# Altium project 3PO.PrjPcb
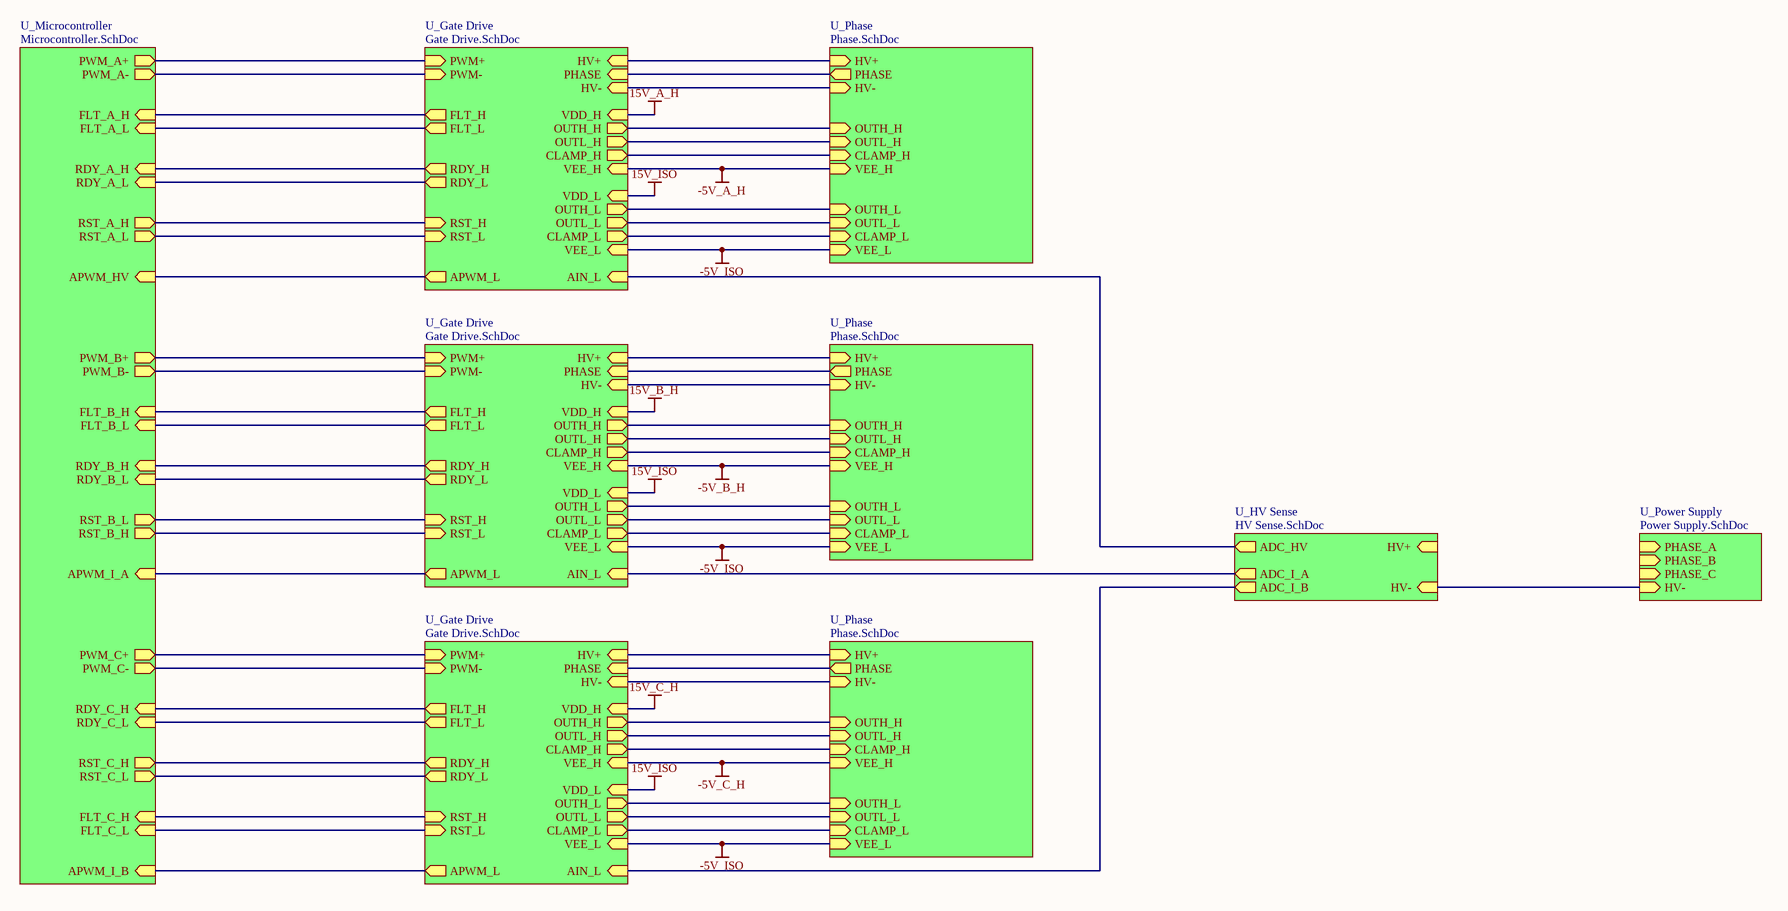
[diagram p0: Inverter.SchDoc]
EngineerName: Ryan Tran; PartNumber: N/A; Project: 3PO, Inverter; Rev: A; SCH_SCALE: 1:1
6 sheets, 166 parts. Net scope: hierarchical (ports join the sheet entries above them; power ports are global).
Sheets:
  Inverter.SchDoc
    U_Phase = Phase.SchDoc
    U_Gate Drive = Gate Drive.SchDoc
    U_Power Supply = Power Supply.SchDoc
    U_HV Sense = HV Sense.SchDoc
    U_Phase = Phase.SchDoc
    U_Gate Drive = Gate Drive.SchDoc
    U_Phase = Phase.SchDoc
    U_Gate Drive = Gate Drive.SchDoc
    U_Microcontroller = Microcontroller.SchDoc

## Sheet Inverter.SchDoc
size 431 x 279 mm; SheetNumber: 1; SheetTotal: 6

### Sub-sheets
U_Gate Drive = Gate Drive.SchDoc: PWM+ (in), PWM- (in), FLT_H (out), RDY_H (out), RST_H (in), OUTL_H (out), OUTH_H (out), CLAMP_H (out), FLT_L (out), OUTL_L (out), OUTH_L (out), CLAMP_L (out), RDY_L (out), HV- (in), RST_L (in), HV+ (in), PHASE (in), VEE_L (in), VDD_L (in), VDD_H (in), VEE_H (in), AIN_L (in), APWM_L (out)
U_Gate Drive = Gate Drive.SchDoc: PWM+ (in), PWM- (in), FLT_H (out), RDY_H (out), RST_H (in), OUTL_H (out), OUTH_H (out), CLAMP_H (out), FLT_L (out), OUTL_L (out), OUTH_L (out), CLAMP_L (out), RDY_L (out), HV- (in), RST_L (in), HV+ (in), PHASE (in), VEE_L (in), VDD_L (in), VDD_H (in), VEE_H (in), AIN_L (in), APWM_L (out)
U_Gate Drive = Gate Drive.SchDoc: PWM+ (in), PWM- (in), FLT_H (out), RDY_H (out), RST_H (in), OUTL_H (out), OUTH_H (out), CLAMP_H (out), FLT_L (out), OUTL_L (out), OUTH_L (out), CLAMP_L (out), RDY_L (out), HV- (in), RST_L (in), HV+ (in), PHASE (in), VEE_L (in), VDD_L (in), VDD_H (in), VEE_H (in), AIN_L (in), APWM_L (out)
U_HV Sense = HV Sense.SchDoc: HV- (in), HV+ (in), ADC_HV (out), ADC_I_A (out), ADC_I_B (out)
U_Microcontroller = Microcontroller.SchDoc: PWM_A+ (out), PWM_A- (out), PWM_B+ (out), PWM_B- (out), PWM_C+ (out), PWM_C- (out), FLT_A_L (in), FLT_A_H (in), FLT_B_L (in), FLT_B_H (in), FLT_C_L (in), FLT_C_H (in), RDY_A_L (in), RDY_A_H (in), RDY_B_L (in), RDY_B_H (in), RDY_C_L (in), RDY_C_H (in), RST_A_L (out), RST_A_H (out), RST_B_L (out), RST_B_H (out), RST_C_L (out), RST_C_H (out), APWM_I_A (in), APWM_HV (in), APWM_I_B (in)
U_Phase = Phase.SchDoc: OUTH_H (in), OUTL_H (in), PHASE (out), CLAMP_H (in), VEE_H (in), OUTH_L (in), OUTL_L (in), CLAMP_L (in), VEE_L (in), HV+ (in), HV- (in)
U_Phase = Phase.SchDoc: OUTH_H (in), OUTL_H (in), PHASE (out), CLAMP_H (in), VEE_H (in), OUTH_L (in), OUTL_L (in), CLAMP_L (in), VEE_L (in), HV+ (in), HV- (in)
U_Phase = Phase.SchDoc: OUTH_H (in), OUTL_H (in), PHASE (out), CLAMP_H (in), VEE_H (in), OUTH_L (in), OUTL_L (in), CLAMP_L (in), VEE_L (in), HV+ (in), HV- (in)
U_Power Supply = Power Supply.SchDoc: PHASE_A (in), PHASE_B (in), PHASE_C (in), HV- (in)

### Nets
15V_ISO: sheet U_Gate Drive/VDD_L, sheet U_Gate Drive/VDD_L, sheet U_Gate Drive/VDD_L
-5V_A_H: sheet U_Phase/VEE_H, sheet U_Gate Drive/VEE_H
-5V_B_H: sheet U_Phase/VEE_H, sheet U_Gate Drive/VEE_H
-5V_C_H: sheet U_Phase/VEE_H, sheet U_Gate Drive/VEE_H
-5V_ISO: sheet U_Phase/VEE_L, sheet U_Gate Drive/VEE_L, sheet U_Phase/VEE_L, sheet U_Gate Drive/VEE_L, sheet U_Phase/VEE_L, sheet U_Gate Drive/VEE_L
PHASE: sheet U_Phase/PHASE, sheet U_Gate Drive/PHASE
PHASE: sheet U_Phase/PHASE, sheet U_Gate Drive/PHASE  [a separate net that carries the same name]
PHASE: sheet U_Phase/PHASE, sheet U_Gate Drive/PHASE  [a separate net that carries the same name]
PWM+: sheet U_Gate Drive/PWM+, sheet U_Microcontroller/PWM_A+
PWM+: sheet U_Gate Drive/PWM+, sheet U_Microcontroller/PWM_B+  [a separate net that carries the same name]
PWM+: sheet U_Gate Drive/PWM+, sheet U_Microcontroller/PWM_C+  [a separate net that carries the same name]
PWM-: sheet U_Gate Drive/PWM-, sheet U_Microcontroller/PWM_A-
PWM-: sheet U_Gate Drive/PWM-, sheet U_Microcontroller/PWM_B-  [a separate net that carries the same name]
PWM-: sheet U_Gate Drive/PWM-, sheet U_Microcontroller/PWM_C-  [a separate net that carries the same name]
NetC11_U_Gate_Drive#1_1: sheet U_Phase/HV-, sheet U_Gate Drive/HV-
NetC11_U_Gate_Drive#2_1: sheet U_Phase/HV-, sheet U_Gate Drive/HV-
NetC11_U_Gate_Drive#3_1: sheet U_Phase/HV-, sheet U_Gate Drive/HV-
NetD1_U_Gate_Drive#1_2: sheet U_Phase/HV+, sheet U_Gate Drive/HV+
NetD1_U_Gate_Drive#2_2: sheet U_Phase/HV+, sheet U_Gate Drive/HV+
NetD1_U_Gate_Drive#3_2: sheet U_Phase/HV+, sheet U_Gate Drive/HV+
NetJ1_50: sheet U_Gate Drive/FLT_H, sheet U_Microcontroller/FLT_A_H
NetJ1_52: sheet U_Gate Drive/FLT_L, sheet U_Microcontroller/FLT_A_L
NetJ1_54: sheet U_Gate Drive/FLT_H, sheet U_Microcontroller/FLT_B_H
NetJ1_56: sheet U_Gate Drive/FLT_L, sheet U_Microcontroller/FLT_B_L
NetJ1_58: sheet U_Gate Drive/RST_H, sheet U_Microcontroller/FLT_C_H
NetJ1_60: sheet U_Gate Drive/RST_L, sheet U_Microcontroller/FLT_C_L
NetJ1_66: sheet U_Gate Drive/RST_H, sheet U_Microcontroller/RST_A_H
NetJ1_67: sheet U_Gate Drive/RDY_H, sheet U_Microcontroller/RDY_A_H
NetJ1_68: sheet U_Gate Drive/RST_L, sheet U_Microcontroller/RST_A_L
NetJ1_69: sheet U_Gate Drive/RDY_L, sheet U_Microcontroller/RDY_A_L
NetJ1_70: sheet U_Gate Drive/RST_L, sheet U_Microcontroller/RST_B_H
NetJ1_71: sheet U_Gate Drive/RDY_H, sheet U_Microcontroller/RDY_B_H
NetJ1_72: sheet U_Gate Drive/RST_H, sheet U_Microcontroller/RST_B_L
NetJ1_73: sheet U_Gate Drive/RDY_L, sheet U_Microcontroller/RDY_B_L
NetJ1_74: sheet U_Gate Drive/RDY_H, sheet U_Microcontroller/RST_C_H
NetJ1_75: sheet U_Gate Drive/FLT_H, sheet U_Microcontroller/RDY_C_H
NetJ1_76: sheet U_Gate Drive/RDY_L, sheet U_Microcontroller/RST_C_L
NetJ1_77: sheet U_Gate Drive/FLT_L, sheet U_Microcontroller/RDY_C_L
NetJ1_78: sheet U_Gate Drive/APWM_L, sheet U_Microcontroller/APWM_HV
NetJ1_80: sheet U_Gate Drive/APWM_L, sheet U_Microcontroller/APWM_I_A
NetJ1_82: sheet U_Gate Drive/APWM_L, sheet U_Microcontroller/APWM_I_B
NetPS4_6: sheet U_Power Supply/HV-, sheet U_HV Sense/HV-
NetR15_U_Phase#1_1: sheet U_Phase/OUTL_H, sheet U_Gate Drive/OUTL_H
NetR15_U_Phase#2_1: sheet U_Phase/OUTL_H, sheet U_Gate Drive/OUTL_H
NetR15_U_Phase#3_1: sheet U_Phase/OUTL_H, sheet U_Gate Drive/OUTL_H
NetR16_U_Phase#1_1: sheet U_Phase/OUTH_H, sheet U_Gate Drive/OUTH_H
NetR16_U_Phase#2_1: sheet U_Phase/OUTH_H, sheet U_Gate Drive/OUTH_H
NetR16_U_Phase#3_1: sheet U_Phase/OUTH_H, sheet U_Gate Drive/OUTH_H
NetR19_U_Phase#1_1: sheet U_Phase/CLAMP_H, sheet U_Gate Drive/CLAMP_H
NetR19_U_Phase#2_1: sheet U_Phase/CLAMP_H, sheet U_Gate Drive/CLAMP_H
NetR19_U_Phase#3_1: sheet U_Phase/CLAMP_H, sheet U_Gate Drive/CLAMP_H
NetR21_U_Phase#1_1: sheet U_Phase/OUTL_L, sheet U_Gate Drive/OUTL_L
NetR21_U_Phase#2_1: sheet U_Phase/OUTL_L, sheet U_Gate Drive/OUTL_L
NetR21_U_Phase#3_1: sheet U_Phase/OUTL_L, sheet U_Gate Drive/OUTL_L
NetR22_U_Phase#1_1: sheet U_Phase/OUTH_L, sheet U_Gate Drive/OUTH_L
NetR22_U_Phase#2_1: sheet U_Phase/OUTH_L, sheet U_Gate Drive/OUTH_L
NetR22_U_Phase#3_1: sheet U_Phase/OUTH_L, sheet U_Gate Drive/OUTH_L
NetR25_U_Phase#1_1: sheet U_Phase/CLAMP_L, sheet U_Gate Drive/CLAMP_L
NetR25_U_Phase#2_1: sheet U_Phase/CLAMP_L, sheet U_Gate Drive/CLAMP_L
NetR25_U_Phase#3_1: sheet U_Phase/CLAMP_L, sheet U_Gate Drive/CLAMP_L
NetR36_1: sheet U_Gate Drive/AIN_L, sheet U_HV Sense/ADC_HV
NetU2_U_Gate_Drive#2_1: sheet U_HV Sense/ADC_I_A, sheet U_Gate Drive/AIN_L
NetU2_U_Gate_Drive#3_1: sheet U_HV Sense/ADC_I_B, sheet U_Gate Drive/AIN_L

### Notes on the sheet
- Title
- Project
- Scale
- Size
- B
- Part Number
- Engineer
- Sheet
- of
- Rev

## Sheet Phase.SchDoc
size 431 x 279 mm; SheetNumber: 3; SheetTotal: 4
Used 3 times, as channels U_Phase, U_Phase, U_Phase. Parts and nets are listed once, with the designators drawn on the sheet.
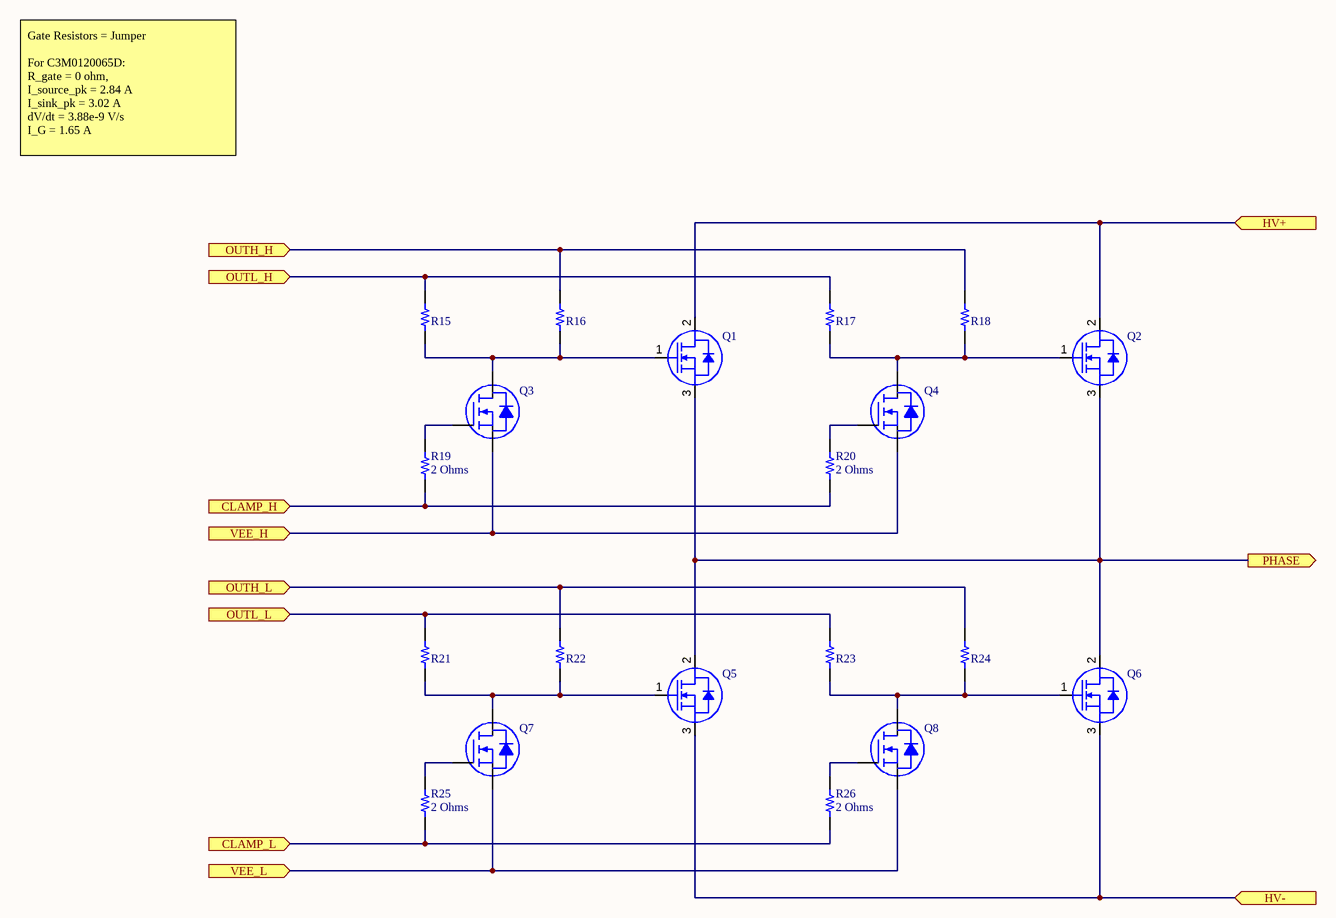
[diagram p1: Phase.SchDoc]

### Parts
Q1  C3M0120065D  (value not drawn)
Q2  C3M0120065D  (value not drawn)
Q3  IRFML8244TRPBF  [INFINEON SOT-23-3]  (value not drawn)
Q4  IRFML8244TRPBF  [INFINEON SOT-23-3]  (value not drawn)
Q5  C3M0120065D  (value not drawn)
Q6  C3M0120065D  (value not drawn)
Q7  IRFML8244TRPBF  [INFINEON SOT-23-3]  (value not drawn)
Q8  IRFML8244TRPBF  [INFINEON SOT-23-3]  (value not drawn)
R15  (no value)  [RES 0805_2012]
R16  (no value)  [RES 0805_2012]
R17  (no value)  [RES 0805_2012]
R18  (no value)  [RES 0805_2012]
R19  2 Ohms  [RES 0805_2012]
R20  2 Ohms  [RES 0805_2012]
R21  (no value)  [RES 0805_2012]
R22  (no value)  [RES 0805_2012]
R23  (no value)  [RES 0805_2012]
R24  (no value)  [RES 0805_2012]
R25  2 Ohms  [RES 0805_2012]
R26  2 Ohms  [RES 0805_2012]

### Ports
CLAMP_H (in), CLAMP_L (in), HV+ (in), HV- (in), OUTH_H (in), OUTH_L (in), OUTL_H (in), OUTL_L (in), PHASE (out), VEE_H (in), VEE_L (in)

### Nets
CLAMP_H: R19.1 R20.1 ; port CLAMP_H
CLAMP_L: R25.1 R26.1 ; port CLAMP_L
HV+: Q1.2(DRAIN) Q2.2(DRAIN) ; port HV+
HV-: Q5.3(SOURCE) Q6.3(SOURCE) ; port HV-
OUTH_H: R16.1 R18.1 ; port OUTH_H
OUTH_L: R22.1 R24.1 ; port OUTH_L
OUTL_H: R15.1 R17.1 ; port OUTL_H
OUTL_L: R21.1 R23.1 ; port OUTL_L
PHASE: Q1.3(SOURCE) Q2.3(SOURCE) Q5.2(DRAIN) Q6.2(DRAIN) ; port PHASE
VEE_H: Q3.2(S) Q4.2(S) ; port VEE_H
VEE_L: Q7.2(S) Q8.2(S) ; port VEE_L
NetQ1_1: Q1.1(GATE) Q3.3(D) R15.2 R16.2
NetQ2_1: Q2.1(GATE) Q4.3(D) R17.2 R18.2
NetQ3_1: Q3.1(G) R19.2
NetQ4_1: Q4.1(G) R20.2
NetQ5_1: Q5.1(GATE) Q7.3(D) R21.2 R22.2
NetQ6_1: Q6.1(GATE) Q8.3(D) R23.2 R24.2
NetQ7_1: Q7.1(G) R25.2
NetQ8_1: Q8.1(G) R26.2

### Channels
U_Phase: designators end in _U_Phase#1; ports CLAMP_H=NetR19_U_Phase#1_1 CLAMP_L=NetR25_U_Phase#1_1 HV+=NetD1_U_Gate_Drive#1_2 HV-=NetC11_U_Gate_Drive#1_1 OUTH_H=NetR16_U_Phase#1_1 OUTH_L=NetR22_U_Phase#1_1 OUTL_H=NetR15_U_Phase#1_1 OUTL_L=NetR21_U_Phase#1_1 PHASE=PHASE VEE_H=-5V_A_H VEE_L=-5V_ISO
U_Phase: designators end in _U_Phase#2; ports CLAMP_H=NetR19_U_Phase#2_1 CLAMP_L=NetR25_U_Phase#2_1 HV+=NetD1_U_Gate_Drive#2_2 HV-=NetC11_U_Gate_Drive#2_1 OUTH_H=NetR16_U_Phase#2_1 OUTH_L=NetR22_U_Phase#2_1 OUTL_H=NetR15_U_Phase#2_1 OUTL_L=NetR21_U_Phase#2_1 PHASE=PHASE VEE_H=-5V_B_H VEE_L=-5V_ISO
U_Phase: designators end in _U_Phase#3; ports CLAMP_H=NetR19_U_Phase#3_1 CLAMP_L=NetR25_U_Phase#3_1 HV+=NetD1_U_Gate_Drive#3_2 HV-=NetC11_U_Gate_Drive#3_1 OUTH_H=NetR16_U_Phase#3_1 OUTH_L=NetR22_U_Phase#3_1 OUTL_H=NetR15_U_Phase#3_1 OUTL_L=NetR21_U_Phase#3_1 PHASE=PHASE VEE_H=-5V_C_H VEE_L=-5V_ISO

### Notes on the sheet
- Gate Resistors = Jumper
  For C3M0120065D:
  R_gate = 0 ohm,
  I_source_pk = 2.84 A
  I_sink_pk = 3.02 A
  dV/dt = 3.88e-9 V/s
  I_G = 1.65 A
- Title
- Project
- Scale
- Size
- B
- Part Number
- Engineer
- Sheet
- of
- Rev

### Library data of the parts
Q1 Q2 Q5 Q6 = C3M0120065D: N-Channel 650 V 22A (Tc) 98W (Tc) Through Hole TO-247-3
Q3 Q4 Q7 Q8 = IRFML8244TRPBF: MOSFET N-CH 25V 5.8A SOT23; Manufacturer: Infineon Technologies; Current - Continuous Drain (Id) @ 25°C: 5.8A (Ta); Drive Voltage (Max Rds On,  Min Rds On): 4.5V, 10V; FET Type: N-Channel; Gate Charge (Qg) (Max) @ Vgs: 5.4nC @ 10V; Input Capacitance (Ciss) (Max) @ Vds: 430pF @ 10V; Power Dissipation (Max): 1.25W (Ta); Rds On (Max) @ Id, Vgs: 24mOhm @ 5.8A, 10V; Vgs (Max): ±20V; Vgs(th) (Max) @ Id: 2.35V @ 10µA; Part Number: IRFML8244TRPBF; ComponentLink1Description: Datasheet; ComponentLink1URL: https://www.infineon.com/dgdl/irfml8244pbf.pdf?fileId=5546d462533600a40153562817c91fc0; ComponentLink2Description: DigiKey Link; ComponentLink2URL: http://digikey.com/product-detail/en/infineon-technologies/IRFML8244TRPBF/IRFML8244TRPBFCT-ND/2538166; Drain to Source Voltage (Vdss): 25V; LastUpdated: 9/2/2020 1:25:05 AM; Lifecycle Status: Active; Minimum Order: 1; Mounting Type: Surface Mount; Operating Temperature: -55°C ~ 150°C (TJ); Package / Case: TO-236-3, SC-59, SOT-23-3; Packaging: TapeAndReel; Part Status: Active; Price: 0.10; Series: HEXFET®; Supplier 1: DigiKey; Supplier Part Number 1: IRFML8244TRPBFCT-ND; Supplier Device Package: SOT-23; Technology: MOSFET (Metal Oxide)
R15-R18 R21-R24 = 5107: RES 0 OHM JUMPER 0805; Part Number: 5107; Manufacturer: Keystone Electronics; Power (Watts): 0.5W, 1/2W; ComponentLink1Description: Datasheet; ComponentLink1URL: http://www.keyelco.com/product-pdf.cfm?p=14350; ComponentLink2Description: DigiKey Link; ComponentLink2URL: http://digikey.com/product-detail/en/keystone-electronics/5107/36-5107CT-ND/7942984; Composition: Metal Element; Device Package: 0805 (2012 Metric); Height - Seated (Max): 0.033" (0.84mm); LastUpdated: 9/2/2020 1:14:45 AM; Lifecycle Status: Active; Minimum Order: 1; Number of Terminations: 2; Package / Case: 0805 (2012 Metric); Packaging: TapeAndReel; PartId: 45276; Part Status: Active; Price: 0.16; Series: -; Size / Dimension: 0.079" L x 0.049" W (2.00mm x 1.25mm); Supplier 1: DigiKey; Supplier Part Number 1: 36-5107CT-ND; Supplier Device Package: 0805; Tolerance: Jumper
R19 R20 R25 R26 = CRCW08052R00JNEA: RES SMD 2 OHM 5% 1/8W 0805; Manufacturer: Vishay Dale; Power (Watts): 0.125W, 1/8W; Temperature Coefficient: ±200ppm/°C; Part Number: CRCW08052R00JNEA; Value: 2 Ohms; ComponentLink1Description: Datasheet; ComponentLink1URL: http://www.vishay.com/docs/20035/dcrcwe3.pdf; ComponentLink2Description: DigiKey Link; ComponentLink2URL: http://digikey.com/product-detail/en/vishay-dale/CRCW08052R00JNEA/541-2.0ACT-ND/1180275; Composition: Thick Film; Device Package: 0805 (2012 Metric); Features: Automotive AEC-Q200; Height - Seated (Max): 0.020" (0.50mm); LastUpdated: 9/2/2020 1:14:42 AM; Lifecycle Status: Active; Minimum Order: 1; Number of Terminations: 2; Operating Temperature: -55°C ~ 155°C; Package / Case: 0805 (2012 Metric); Packaging: CutTape; PartId: 46488; Part Status: Active; Price: 0.10; Ratings: AEC-Q200; Resistance: 2 Ohms; Series: CRCW; Size / Dimension: 0.079" L x 0.049" W (2.00mm x 1.25mm); Supplier 1: DigiKey; Supplier Part Number 1: 541-2.0ACT-ND; Supplier Device Package: 0805; Tolerance: ±5%

## Sheet Gate Drive.SchDoc
size 431 x 279 mm; Organization: ORGANIZATION; Address1: ADDRESS 1; Address2: ADDRESS 2; Address3: ADDRESS 3; Address4: ADDRESS 4; DocumentNumber: 1; SheetNumber: 2; SheetTotal: 6
Used 3 times, as channels U_Gate Drive, U_Gate Drive, U_Gate Drive. Parts and nets are listed once, with the designators drawn on the sheet.
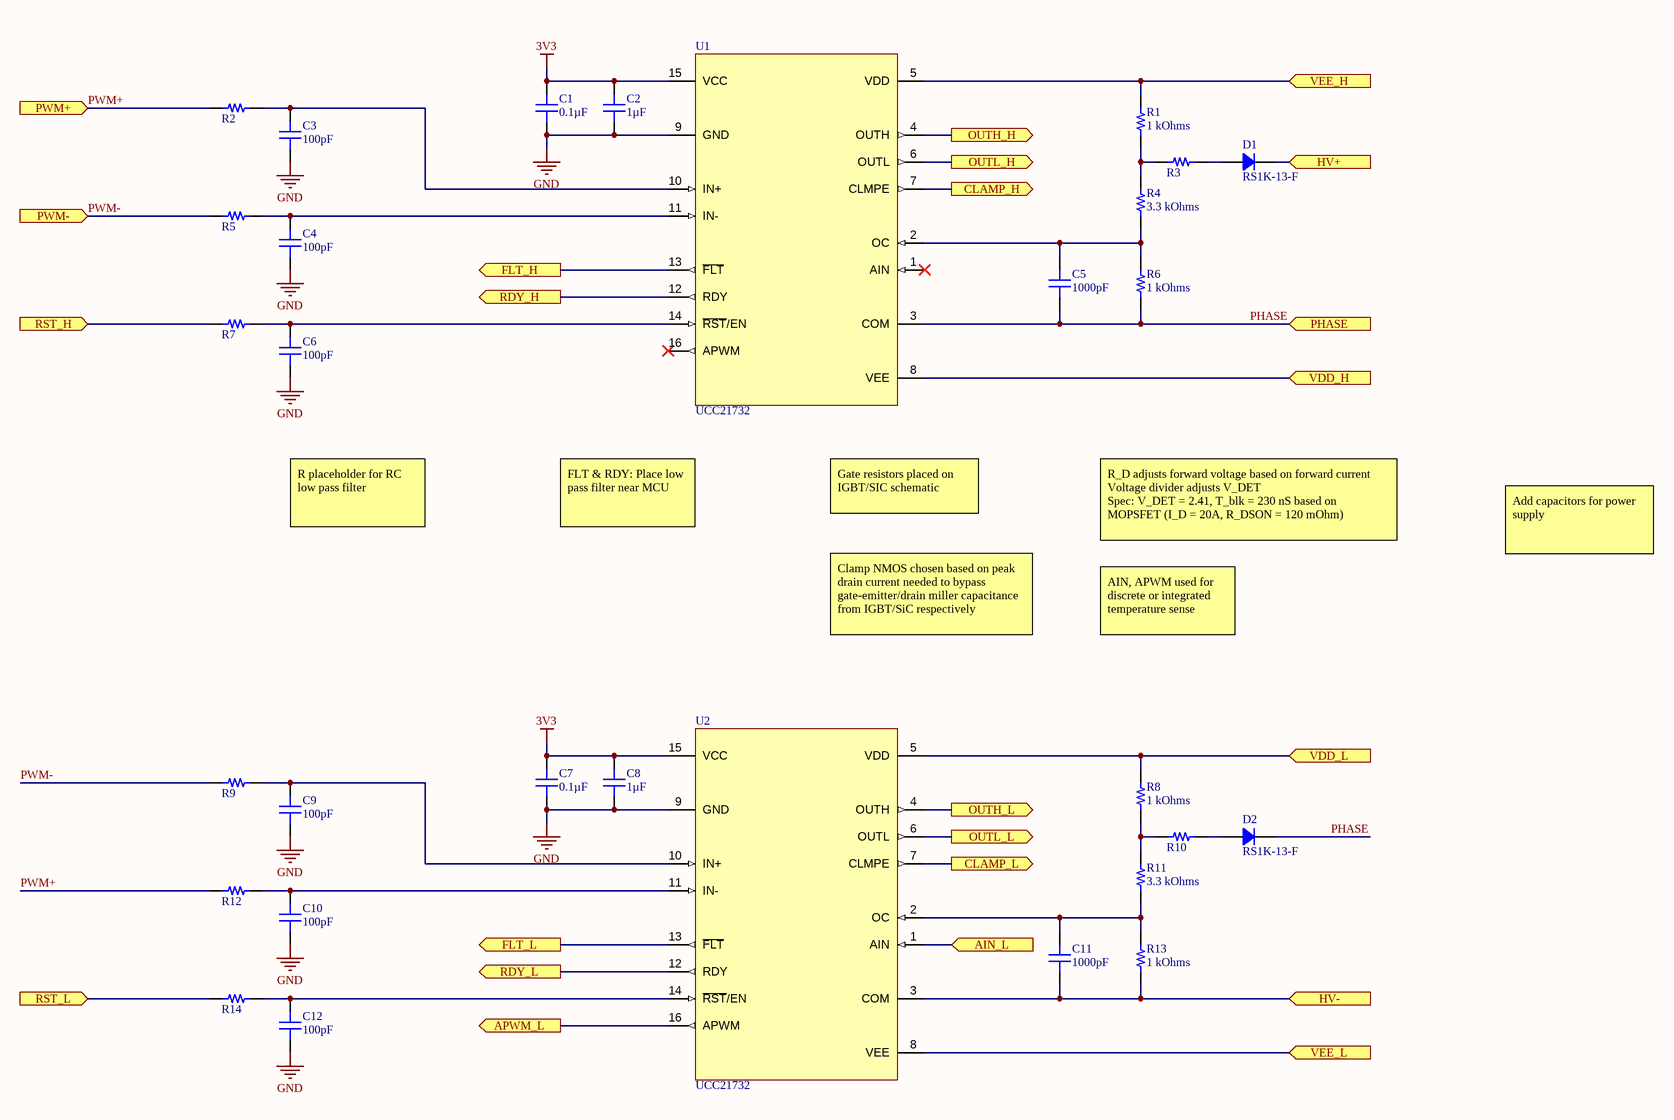
[diagram p2: Gate Drive.SchDoc]

### Parts
C1  0.1µF  [CAP 0805_2012]
C2  1µF  [CAP 0805_2012]
C3  100pF  [CAP 0805_2012]
C4  100pF  [CAP 0805_2012]
C5  1000pF  [CAP 0805_2012]
C6  100pF  [CAP 0805_2012]
C7  0.1µF  [CAP 0805_2012]
C8  1µF  [CAP 0805_2012]
C9  100pF  [CAP 0805_2012]
C10  100pF  [CAP 0805_2012]
C11  1000pF  [CAP 0805_2012]
C12  100pF  [CAP 0805_2012]
D1  RS1K-13-F  [DO214AC SMA]
D2  RS1K-13-F  [DO214AC SMA]
R1  1 kOhms  [RES 0805_2012]
R2  (no value)  [RES 0805_2012]
R3  (no value)  [RES 0805_2012]
R4  3.3 kOhms  [RES 0805_2012]
R5  (no value)  [RES 0805_2012]
R6  1 kOhms  [RES 0805_2012]
R7  (no value)  [RES 0805_2012]
R8  1 kOhms  [RES 0805_2012]
R9  (no value)  [RES 0805_2012]
R10  (no value)  [RES 0805_2012]
R11  3.3 kOhms  [RES 0805_2012]
R12  (no value)  [RES 0805_2012]
R13  1 kOhms  [RES 0805_2012]
R14  (no value)  [RES 0805_2012]
U1  UCC21732
U2  UCC21732

### Ports
AIN_L (in), APWM_L (out), CLAMP_H (out), CLAMP_L (out), FLT_H (out), FLT_L (out), HV+ (in), HV- (in), OUTH_H (out), OUTH_L (out), OUTL_H (out), OUTL_L (out), PHASE (in), PWM+ (in), PWM- (in), RDY_H (out), RDY_L (out), RST_H (in), RST_L (in), VDD_H (in), VDD_L (in), VEE_H (in), VEE_L (in)

### Nets
3V3: C1.2 C2.2 C7.2 C8.2 U1.15(VCC) U2.15(VCC)
GND: C1.1 C2.1 C3.1 C4.1 C6.1 C7.1 C8.1 C9.1 C10.1 C12.1 U1.9(GND) U2.9(GND)
AIN_L: U2.1(AIN) ; port AIN_L
APWM_L: U2.16(APWM) ; port APWM_L
CLAMP_H: U1.7(CLMPE) ; port CLAMP_H
CLAMP_L: U2.7(CLMPE) ; port CLAMP_L
FLT_H: U1.13(~{FLT}) ; port FLT_H
FLT_L: U2.13(~{FLT}) ; port FLT_L
HV+: D1.2 ; port HV+
HV-: C11.1 R13.1 U2.3(COM) ; port HV-
OUTH_H: U1.4(OUTH) ; port OUTH_H
OUTH_L: U2.4(OUTH) ; port OUTH_L
OUTL_H: U1.6(OUTL) ; port OUTL_H
OUTL_L: U2.6(OUTL) ; port OUTL_L
PHASE: C5.1 D2.2 R6.1 U1.3(COM) ; port PHASE
PWM+: R2.1 R12.1 ; port PWM+
PWM-: R5.1 R9.1 ; port PWM-
RDY_H: U1.12(RDY) ; port RDY_H
RDY_L: U2.12(RDY) ; port RDY_L
RST_H: R7.1 ; port RST_H
RST_L: R14.1 ; port RST_L
VDD_H: U1.8(VEE) ; port VDD_H
VDD_L: R8.2 U2.5(VDD) ; port VDD_L
VEE_H: R1.2 U1.5(VDD) ; port VEE_H
VEE_L: U2.8(VEE) ; port VEE_L
NetC3_2: C3.2 R2.2 U1.10(IN+)
NetC4_2: C4.2 R5.2 U1.11(IN-)
NetC5_2: C5.2 R4.1 R6.2 U1.2(OC)
NetC6_2: C6.2 R7.2 U1.14(~{RST}/EN)
NetC9_2: C9.2 R9.2 U2.10(IN+)
NetC10_2: C10.2 R12.2 U2.11(IN-)
NetC11_2: C11.2 R11.1 R13.2 U2.2(OC)
NetC12_2: C12.2 R14.2 U2.14(~{RST}/EN)
NetD1_1: D1.1 R3.2
NetD2_1: D2.1 R10.2
NetR1_1: R1.1 R3.1 R4.2
NetR8_1: R8.1 R10.1 R11.2

Not connected (* = marked no-connect by the designer): U1 1(AIN)* 16(APWM)*

### Channels
U_Gate Drive: designators end in _U_Gate_Drive#1; ports AIN_L=NetR36_1 APWM_L=NetJ1_78 CLAMP_H=NetR19_U_Phase#1_1 CLAMP_L=NetR25_U_Phase#1_1 FLT_H=NetJ1_50 FLT_L=NetJ1_52 HV+=NetD1_U_Gate_Drive#1_2 HV-=NetC11_U_Gate_Drive#1_1 OUTH_H=NetR16_U_Phase#1_1 OUTH_L=NetR22_U_Phase#1_1 OUTL_H=NetR15_U_Phase#1_1 OUTL_L=NetR21_U_Phase#1_1 PHASE=PHASE PWM+=PWM+ PWM-=PWM- RDY_H=NetJ1_67 RDY_L=NetJ1_69 RST_H=NetJ1_66 RST_L=NetJ1_68 VDD_H=15V_A_H VDD_L=15V_ISO VEE_H=-5V_A_H VEE_L=-5V_ISO
U_Gate Drive: designators end in _U_Gate_Drive#2; ports AIN_L=NetU2_U_Gate_Drive#2_1 APWM_L=NetJ1_80 CLAMP_H=NetR19_U_Phase#2_1 CLAMP_L=NetR25_U_Phase#2_1 FLT_H=NetJ1_54 FLT_L=NetJ1_56 HV+=NetD1_U_Gate_Drive#2_2 HV-=NetC11_U_Gate_Drive#2_1 OUTH_H=NetR16_U_Phase#2_1 OUTH_L=NetR22_U_Phase#2_1 OUTL_H=NetR15_U_Phase#2_1 OUTL_L=NetR21_U_Phase#2_1 PHASE=PHASE PWM+=PWM+ PWM-=PWM- RDY_H=NetJ1_71 RDY_L=NetJ1_73 RST_H=NetJ1_72 RST_L=NetJ1_70 VDD_H=15V_B_H VDD_L=15V_ISO VEE_H=-5V_B_H VEE_L=-5V_ISO
U_Gate Drive: designators end in _U_Gate_Drive#3; ports AIN_L=NetU2_U_Gate_Drive#3_1 APWM_L=NetJ1_82 CLAMP_H=NetR19_U_Phase#3_1 CLAMP_L=NetR25_U_Phase#3_1 FLT_H=NetJ1_75 FLT_L=NetJ1_77 HV+=NetD1_U_Gate_Drive#3_2 HV-=NetC11_U_Gate_Drive#3_1 OUTH_H=NetR16_U_Phase#3_1 OUTH_L=NetR22_U_Phase#3_1 OUTL_H=NetR15_U_Phase#3_1 OUTL_L=NetR21_U_Phase#3_1 PHASE=PHASE PWM+=PWM+ PWM-=PWM- RDY_H=NetJ1_74 RDY_L=NetJ1_76 RST_H=NetJ1_58 RST_L=NetJ1_60 VDD_H=15V_C_H VDD_L=15V_ISO VEE_H=-5V_C_H VEE_L=-5V_ISO

### Notes on the sheet
- R placeholder for RC low pass filter
- FLT & RDY: Place low pass filter near MCU
- Gate resistors placed on IGBT/SIC schematic
- R_D adjusts forward voltage based on forward current
  Voltage divider adjusts V_DET
  Spec: V_DET = 2.41, T_blk = 230 nS based on MOPSFET (I_D = 20A, R_DSON = 120 mOhm)
- Add capacitors for power supply
- Clamp NMOS chosen based on peak drain current needed to bypass gate-emitter/drain miller capacitance from IGBT/SiC respectively
- AIN, APWM used for discrete or integrated temperature sense
- Title
- Project
- Scale
- Size
- B
- Part Number
- Engineer
- Sheet
- of
- Rev

### Library data of the parts
C1 C7 = CGA4J2X7R2A104K125AE: CAP CER 0.1UF 100V X7R 0805; Manufacturer: TDK Corporation; Tolerance: ±10%; Part Number: CGA4J2X7R2A104K125AE; Value: 0.1µF; Applications: Automotive, Boardflex Sensitive; Capacitance: 0.1µF; ComponentLink1Description: Datasheet; ComponentLink1URL: https://product.tdk.com/info/en/catalog/datasheets/mlcc_automotive_soft_en.pdf?ref_disty=digikey; ComponentLink2Description: DigiKey Link; ComponentLink2URL: http://digikey.com/product-detail/en/tdk-corporation/CGA4J2X7R2A104K125AE/445-15961-1-ND/4490669; Device Package: 0805 (2012 Metric); Features: Soft Termination; LastUpdated: 9/2/2020 1:04:19 AM; Lifecycle Status: Active; Minimum Order: 1; Mounting Type: Surface Mount, MLCC; Operating Temperature: -55°C ~ 125°C; Package / Case: 0805 (2012 Metric); Packaging: TapeAndReel; PartId: 14432; Part Status: Active; Price: 0.07; Ratings: AEC-Q200; Series: CGA; Size / Dimension: 0.079" L x 0.049" W (2.00mm x 1.25mm); Supplier 1: DigiKey; Supplier Part Number 1: 445-15961-1-ND; Temperature Coefficient: X7R; Thickness (Max): 0.057" (1.45mm); Voltage - Rated: 100V
C2 C8 = CGA4J3X7R1E105K125AD: CAP CER 1UF 25V X7R 0805 EPOXY; Manufacturer: TDK Corporation; Tolerance: ±10%; Part Number: CGA4J3X7R1E105K125AD; Value: 1µF; Applications: Automotive; Capacitance: 1µF; ComponentLink1Description: Datasheet; ComponentLink1URL: https://product.tdk.com/info/en/catalog/datasheets/mlcc_automotive_epoxy_en.pdf?ref_disty=digikey; ComponentLink2Description: DigiKey Link; ComponentLink2URL: http://digikey.com/product-detail/en/tdk-corporation/CGA4J3X7R1E105K125AD/445-8811-1-ND/3248259; Device Package: 0805 (2012 Metric); Features: Epoxy Mountable; LastUpdated: 9/2/2020 1:04:19 AM; Lifecycle Status: Active; Minimum Order: 1; Mounting Type: Surface Mount, MLCC, Epoxy; Operating Temperature: -55°C ~ 125°C; Package / Case: 0805 (2012 Metric); Packaging: TapeAndReel; PartId: 14482; Part Status: Active; Price: 0.09; Ratings: AEC-Q200; Series: CGA; Size / Dimension: 0.079" L x 0.049" W (2.00mm x 1.25mm); Supplier 1: DigiKey; Supplier Part Number 1: 445-8811-1-ND; Temperature Coefficient: X7R; Thickness (Max): 0.057" (1.45mm); Voltage - Rated: 25V
C3 C4 C6 C9 C10 C12 = C0805C101K3RAC7800: CAP CER 100PF 25V X7R 0805; Manufacturer: KEMET; Tolerance: ±10%; Part Number: C0805C101K3RAC7800; Value: 100pF; Applications: Bypass, Decoupling; Capacitance: 100pF; ComponentLink1Description: Datasheet; ComponentLink1URL: https://api.kemet.com/component-edge/download/datasheet/C0805C101K3RAC7800.pdf; ComponentLink2Description: DigiKey Link; ComponentLink2URL: http://digikey.com/product-detail/en/kemet/C0805C101K3RAC7800/399-15002-1-ND/7382551; Device Package: 0805 (2012 Metric); LastUpdated: 9/2/2020 1:04:39 AM; Lifecycle Status: Active; Minimum Order: 1; Mounting Type: Surface Mount, MLCC; Operating Temperature: -55°C ~ 125°C; Package / Case: 0805 (2012 Metric); Packaging: TapeAndReel; PartId: 3885; Part Status: Active; Price: 0.05; Series: SMD Comm X7R; Size / Dimension: 0.079" L x 0.049" W (2.00mm x 1.25mm); Supplier 1: DigiKey; Supplier Part Number 1: 399-15002-1-ND; Temperature Coefficient: X7R; Thickness (Max): 0.035" (0.88mm); Voltage - Rated: 25V
C5 C11 = C0805C102J5RACTU: CAP CER 1000PF 50V X7R 0805; Manufacturer: KEMET; Tolerance: ±5%; Part Number: C0805C102J5RACTU; Value: 1000pF; Applications: Bypass, Decoupling; Capacitance: 1000pF; ComponentLink1Description: Datasheet; ComponentLink1URL: https://api.kemet.com/component-edge/download/datasheet/C0805C102J5RACTU.pdf; ComponentLink2Description: DigiKey Link; ComponentLink2URL: http://digikey.com/product-detail/en/kemet/C0805C102J5RACTU/399-1149-1-ND/411424; Device Package: 0805 (2012 Metric); LastUpdated: 9/2/2020 1:04:42 AM; Lifecycle Status: Active; Minimum Order: 1; Mounting Type: Surface Mount, MLCC; Operating Temperature: -55°C ~ 125°C; Package / Case: 0805 (2012 Metric); Packaging: TapeAndReel; PartId: 2505; Part Status: Active; Price: 0.02; Series: SMD Comm X7R; Size / Dimension: 0.079" L x 0.049" W (2.00mm x 1.25mm); Supplier 1: DigiKey; Supplier Part Number 1: 399-1149-1-ND; Temperature Coefficient: X7R; Thickness (Max): 0.035" (0.88mm); Voltage - Rated: 50V
D1 D2 = RS1K-13-F: DIODE GEN PURP 800V 1A SMA; Manufacturer: Diodes Incorporated; Capacitance @ Vr, F: 15pF @ 4V, 1MHz; Current - Reverse Leakage @ Vr: 5µA @ 800V; Diode Type: Standard; Reverse Recovery Time (trr): 500ns; Speed: Fast Recovery =< 500ns, > 200mA (Io); Voltage - Forward (Vf) (Max) @ If: 1.3V @ 1A; Part Number: RS1K-13-F; ComponentLink1Description: Datasheet; ComponentLink1URL: https://www.diodes.com/assets/Datasheets/ds15002.pdf; ComponentLink2Description: DigiKey Link; ComponentLink2URL: http://digikey.com/product-detail/en/diodes-incorporated/RS1K-13-F/RS1K-FDICT-ND/750029; Current - Average Rectified (Io): 1A; LastUpdated: 9/2/2020 1:19:04 AM; Lifecycle Status: Active; Minimum Order: 1; Mounting Type: Surface Mount; Operating Temperature - Junction: -65°C ~ 150°C; Package / Case: DO-214AC, SMA; Packaging: TapeAndReel; PartId: 637; Part Status: Active; Price: 0.10; Series: -; Supplier 1: DigiKey; Supplier Part Number 1: RS1K-FDICT-ND; Supplier Device Package: SMA; Voltage - DC Reverse (Vr) (Max): 800V
R1 R6 R8 R13 = CRCW08051K00JNEAHP: RES SMD 1K OHM 5% 1/2W 0805; Manufacturer: Vishay Dale; Power (Watts): 0.5W, 1/2W; Temperature Coefficient: ±200ppm/°C; Part Number: CRCW08051K00JNEAHP; Value: 1 kOhms; ComponentLink1Description: Datasheet; ComponentLink1URL: http://www.vishay.com/docs/20043/crcwhpe3.pdf; ComponentLink2Description: DigiKey Link; ComponentLink2URL: http://digikey.com/product-detail/en/vishay-dale/CRCW08051K00JNEAHP/541-1.0KTACT-ND/2222900; Composition: Thick Film; Device Package: 0805 (2012 Metric); Features: Automotive AEC-Q200, Pulse Withstanding; Height - Seated (Max): 0.020" (0.50mm); LastUpdated: 9/2/2020 1:15:08 AM; Lifecycle Status: Active; Minimum Order: 1; Number of Terminations: 2; Operating Temperature: -55°C ~ 155°C; Package / Case: 0805 (2012 Metric); Packaging: TapeAndReel; PartId: 34827; Part Status: Active; Price: 0.02; Ratings: AEC-Q200; Resistance: 1 kOhms; Series: CRCW-HP; Size / Dimension: 0.079" L x 0.049" W (2.00mm x 1.25mm); Supplier 1: DigiKey; Supplier Part Number 1: 541-1.0KTACT-ND; Supplier Device Package: 0805; Tolerance: ±5%
R2 R3 R5 R7 R9 R10 R12 R14 = 5107: as R15 on sheet Phase; ComponentLink1Description: Datasheet; ComponentLink1URL: http://www.keyelco.com/product-pdf.cfm?p=14350; ComponentLink2Description: DigiKey Link; ComponentLink2URL: http://digikey.com/product-detail/en/keystone-electronics/5107/36-5107CT-ND/7942984; Composition: Metal Element; Device Package: 0805 (2012 Metric); Height - Seated (Max): 0.033" (0.84mm); LastUpdated: 9/2/2020 1:14:45 AM; Lifecycle Status: Active; Minimum Order: 1; Number of Terminations: 2; Package / Case: 0805 (2012 Metric); Packaging: TapeAndReel; PartId: 45276; Part Status: Active; Price: 0.16; Series: -; Size / Dimension: 0.079" L x 0.049" W (2.00mm x 1.25mm); Supplier 1: DigiKey; Supplier Part Number 1: 36-5107CT-ND; Supplier Device Package: 0805; Tolerance: Jumper
R4 R11 = CRCW08053K30JNEA: RES SMD 3.3K OHM 5% 1/8W 0805; Manufacturer: Vishay Dale; Power (Watts): 0.125W, 1/8W; Temperature Coefficient: ±200ppm/°C; Part Number: CRCW08053K30JNEA; Value: 3.3 kOhms; ComponentLink1Description: Datasheet; ComponentLink1URL: http://www.vishay.com/docs/20035/dcrcwe3.pdf; ComponentLink2Description: DigiKey Link; ComponentLink2URL: http://digikey.com/product-detail/en/vishay-dale/CRCW08053K30JNEA/541-3.3KACT-ND/1180352; Composition: Thick Film; Device Package: 0805 (2012 Metric); Features: Automotive AEC-Q200; Height - Seated (Max): 0.020" (0.50mm); LastUpdated: 9/2/2020 1:14:52 AM; Lifecycle Status: Active; Minimum Order: 1; Number of Terminations: 2; Operating Temperature: -55°C ~ 155°C; Package / Case: 0805 (2012 Metric); Packaging: CutTape; PartId: 42029; Part Status: Active; Price: 0.10; Ratings: AEC-Q200; Resistance: 3.3 kOhms; Series: CRCW; Size / Dimension: 0.079" L x 0.049" W (2.00mm x 1.25mm); Supplier 1: DigiKey; Supplier Part Number 1: 541-3.3KACT-ND; Supplier Device Package: 0805; Tolerance: ±5%
U1 U2 = UCC21732: 10A Gate Driver Capacitive Coupling 5700Vrms 1 Channel 16-SOIC

## Sheet Power Supply.SchDoc
size 431 x 279 mm; SheetNumber: 5; SheetTotal: 6
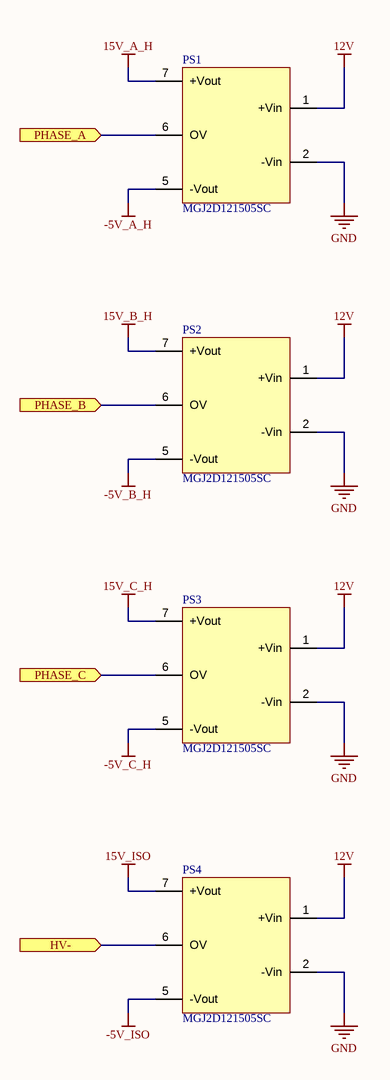
[diagram p3: Power Supply.SchDoc]

### Parts
PS1  MGJ2D121505SC
PS2  MGJ2D121505SC
PS3  MGJ2D121505SC
PS4  MGJ2D121505SC

### Ports
HV- (in), PHASE_A (in), PHASE_B (in), PHASE_C (in)

### Nets
12V: PS1.1(+Vin) PS2.1(+Vin) PS3.1(+Vin) PS4.1(+Vin)
15V_A_H: PS1.7(+Vout)
15V_B_H: PS2.7(+Vout)
15V_C_H: PS3.7(+Vout)
15V_ISO: PS4.7(+Vout)
-5V_A_H: PS1.5(-Vout)
-5V_B_H: PS2.5(-Vout)
-5V_C_H: PS3.5(-Vout)
-5V_ISO: PS4.5(-Vout)
GND: PS1.2(-Vin) PS2.2(-Vin) PS3.2(-Vin) PS4.2(-Vin)
NetPS1_6: PS1.6(OV) ; port PHASE_A
NetPS2_6: PS2.6(OV) ; port PHASE_B
NetPS3_6: PS3.6(OV) ; port PHASE_C
NetPS4_6: PS4.6(OV) ; port HV-

### Notes on the sheet
- Title
- Project
- Scale
- Size
- B
- Part Number
- Engineer
- Sheet
- of
- Rev

### Library data of the parts
PS1-PS4 = MGJ2D121505SC: DC DC CONVERTER 15V -5V 2W

## Sheet HV Sense.SchDoc
size 431 x 279 mm; SheetNumber: 4; SheetTotal: 6
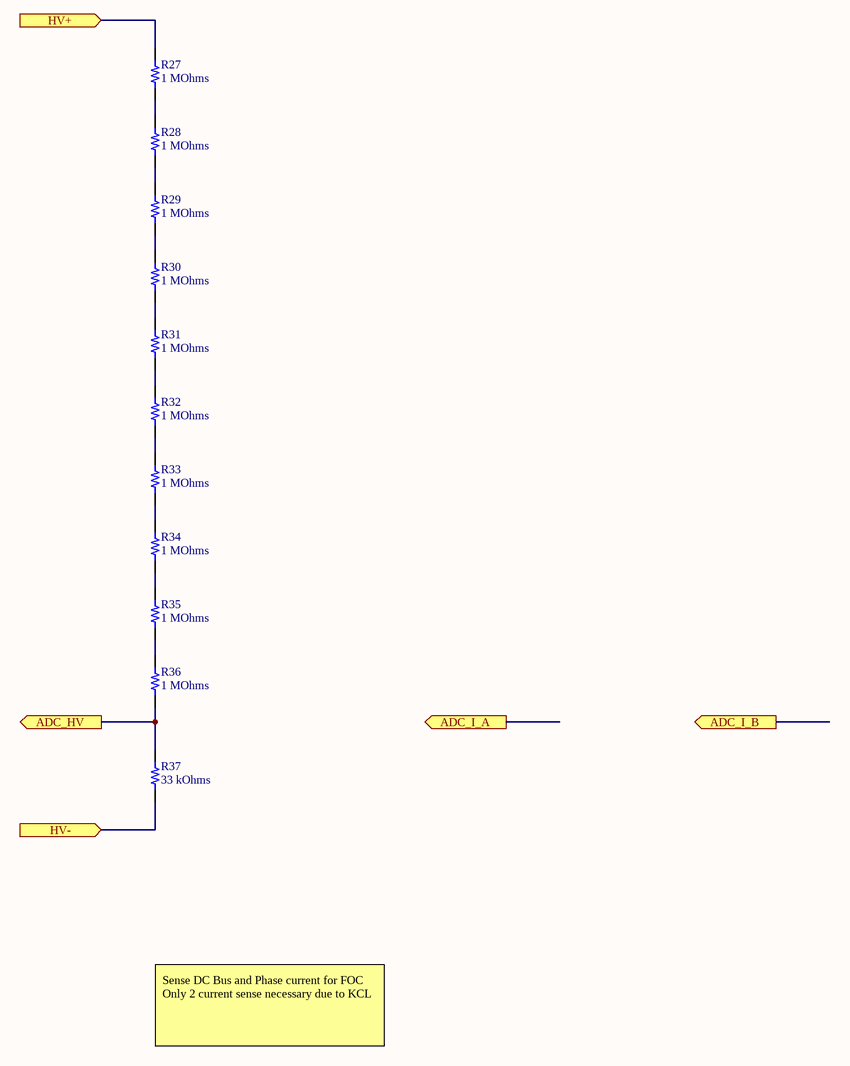
[diagram p4: HV Sense.SchDoc]

### Parts
R27  1 MOhms  [RES 0805_2012]
R28  1 MOhms  [RES 0805_2012]
R29  1 MOhms  [RES 0805_2012]
R30  1 MOhms  [RES 0805_2012]
R31  1 MOhms  [RES 0805_2012]
R32  1 MOhms  [RES 0805_2012]
R33  1 MOhms  [RES 0805_2012]
R34  1 MOhms  [RES 0805_2012]
R35  1 MOhms  [RES 0805_2012]
R36  1 MOhms  [RES 0805_2012]
R37  33 kOhms  [RES 0805_2012]

### Ports
ADC_HV (out), ADC_I_A (out), ADC_I_B (out), HV+ (in), HV- (in)

### Nets
NetPS4_6: R37.1 ; port HV-
NetR27_1: R27.1 R28.2
NetR27_2: R27.2 ; port HV+
NetR28_1: R28.1 R29.2
NetR29_1: R29.1 R30.2
NetR30_1: R30.1 R31.2
NetR31_1: R31.1 R32.2
NetR32_1: R32.1 R33.2
NetR33_1: R33.1 R34.2
NetR34_1: R34.1 R35.2
NetR35_1: R35.1 R36.2
NetR36_1: R36.1 R37.2 ; port ADC_HV

### Notes on the sheet
- Sense DC Bus and Phase current for FOC
  Only 2 current sense necessary due to KCL
- Title
- Project
- Scale
- Size
- B
- Part Number
- Engineer
- Sheet
- of
- Rev

### Library data of the parts
R27-R36 = ERA-6AEB105V: RES 1M OHM 0.1% 1/8W 0805; Manufacturer: Panasonic Electronic Components; Power (Watts): 0.125W, 1/8W; Temperature Coefficient: ±25ppm/°C; Part Number: ERA-6AEB105V; Value: 1 MOhms; ComponentLink1Description: Datasheet; ComponentLink1URL: https://industrial.panasonic.com/cdbs/www-data/pdf/RDM0000/AOA0000C307.pdf; ComponentLink2Description: DigiKey Link; ComponentLink2URL: http://digikey.com/product-detail/en/panasonic-electronic-components/ERA-6AEB105V/P1MDACT-ND/1466019; Composition: Thin Film; Device Package: 0805 (2012 Metric); Features: Automotive AEC-Q200; Height - Seated (Max): 0.024" (0.60mm); LastUpdated: 9/2/2020 1:15:23 AM; Lifecycle Status: Active; Minimum Order: 1; Number of Terminations: 2; Operating Temperature: -55°C ~ 155°C; Package / Case: 0805 (2012 Metric); Packaging: TapeAndReel; PartId: 28069; Part Status: Active; Price: 0.04; Ratings: AEC-Q200; Resistance: 1 MOhms; Series: ERA-6A; Size / Dimension: 0.079" L x 0.049" W (2.00mm x 1.25mm); Supplier 1: DigiKey; Supplier Part Number 1: P1MDACT-ND; Supplier Device Package: 0805; Tolerance: ±0.1%
R37 = ERA-6ARB333V: RES 33K OHM 0.1% 1/8W 0805; Manufacturer: Panasonic Electronic Components; Power (Watts): 0.125W, 1/8W; Temperature Coefficient: ±10ppm/°C; Part Number: ERA-6ARB333V; Value: 33 kOhms; ComponentLink1Description: Datasheet; ComponentLink1URL: https://industrial.panasonic.com/cdbs/www-data/pdf/RDM0000/AOA0000C307.pdf; ComponentLink2Description: DigiKey Link; ComponentLink2URL: http://digikey.com/product-detail/en/panasonic-electronic-components/ERA-6ARB333V/P33KBFCT-ND/3073368; Composition: Thin Film; Device Package: 0805 (2012 Metric); Features: Automotive AEC-Q200; Height - Seated (Max): 0.024" (0.60mm); LastUpdated: 9/2/2020 1:15:11 AM; Lifecycle Status: Active; Minimum Order: 1; Number of Terminations: 2; Operating Temperature: -55°C ~ 155°C; Package / Case: 0805 (2012 Metric); Packaging: TapeAndReel; PartId: 33821; Part Status: Active; Price: 0.20; Ratings: AEC-Q200; Resistance: 33 kOhms; Series: ERA-6A; Size / Dimension: 0.079" L x 0.049" W (2.00mm x 1.25mm); Supplier 1: DigiKey; Supplier Part Number 1: P33KBFCT-ND; Supplier Device Package: 0805; Tolerance: ±0.1%

## Sheet Microcontroller.SchDoc
size 431 x 279 mm; SheetNumber: 4; SheetTotal: 6
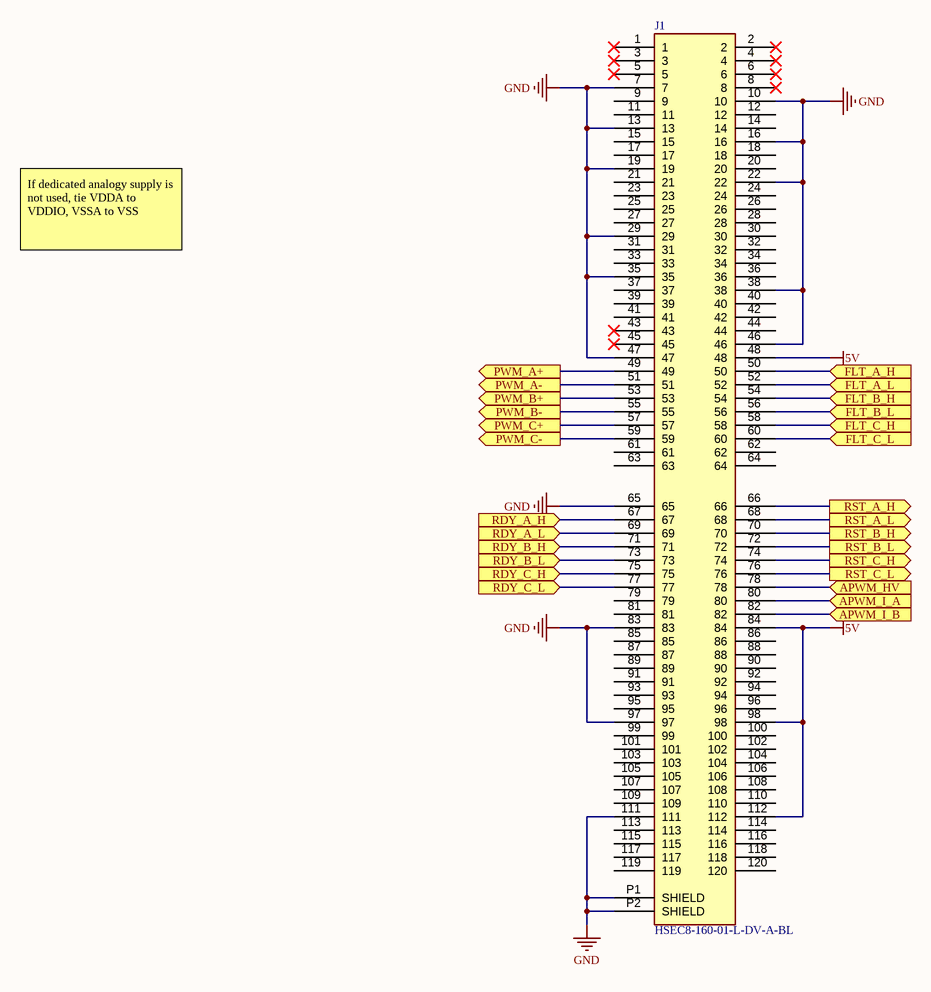
[diagram p5: Microcontroller.SchDoc]

### Parts
J1  HSEC8-160-01-L-DV-A-BL  [SAMTEC_HSEC8-160-01-L-DV-A-BL]

### Ports
APWM_HV (in), APWM_I_A (in), APWM_I_B (in), FLT_A_H (in), FLT_A_L (in), FLT_B_H (in), FLT_B_L (in), FLT_C_H (in), FLT_C_L (in), PWM_A+ (out), PWM_A- (out), PWM_B+ (out), PWM_B- (out), PWM_C+ (out), PWM_C- (out), RDY_A_H (in), RDY_A_L (in), RDY_B_H (in), RDY_B_L (in), RDY_C_H (in), RDY_C_L (in), RST_A_H (out), RST_A_L (out), RST_B_H (out), RST_B_L (out), RST_C_H (out), RST_C_L (out)

### Nets
5V: J1.48 J1.84 J1.98 J1.112
GND: J1.7 J1.10 J1.13 J1.16 J1.19 J1.22 J1.29 J1.35 J1.38 J1.46 J1.47 J1.65 J1.83 J1.97 J1.111 J1.P1(SHIELD) J1.P2(SHIELD)
PWM+: J1.49 ; port PWM_A+
PWM+: J1.53 ; port PWM_B+  [a separate net that carries the same name]
PWM+: J1.57 ; port PWM_C+  [a separate net that carries the same name]
PWM-: J1.51 ; port PWM_A-
PWM-: J1.55 ; port PWM_B-  [a separate net that carries the same name]
PWM-: J1.59 ; port PWM_C-  [a separate net that carries the same name]
NetJ1_50: J1.50 ; port FLT_A_H
NetJ1_52: J1.52 ; port FLT_A_L
NetJ1_54: J1.54 ; port FLT_B_H
NetJ1_56: J1.56 ; port FLT_B_L
NetJ1_58: J1.58 ; port FLT_C_H
NetJ1_60: J1.60 ; port FLT_C_L
NetJ1_66: J1.66 ; port RST_A_H
NetJ1_67: J1.67 ; port RDY_A_H
NetJ1_68: J1.68 ; port RST_A_L
NetJ1_69: J1.69 ; port RDY_A_L
NetJ1_70: J1.70 ; port RST_B_H
NetJ1_71: J1.71 ; port RDY_B_H
NetJ1_72: J1.72 ; port RST_B_L
NetJ1_73: J1.73 ; port RDY_B_L
NetJ1_74: J1.74 ; port RST_C_H
NetJ1_75: J1.75 ; port RDY_C_H
NetJ1_76: J1.76 ; port RST_C_L
NetJ1_77: J1.77 ; port RDY_C_L
NetJ1_78: J1.78 ; port APWM_HV
NetJ1_80: J1.80 ; port APWM_I_A
NetJ1_82: J1.82 ; port APWM_I_B

Not connected (* = marked no-connect by the designer): J1 1* 2* 3* 4* 5* 6* 8* 9 11 12 14 15 17 18 20 21 23 24 25 26 27 28 30 31 32 33 34 36 37 39 40 41 42 43* 44 45* 61 62 63 64 79 81 85 86 87 88 89 90 91 92 93 94 95 96 99 100 101 102 103 104 105 106 107 108 109 110 113 114 115 116 117 118 119 120

### Notes on the sheet
- If dedicated analogy supply is not used, tie VDDA to VDDIO, VSSA to VSS
- Title
- Project
- Scale
- Size
- B
- Part Number
- Engineer
- Sheet
- of
- Rev

### Library data of the parts
J1 = HSEC8-160-01-L-DV-A-BL: .8mm HIGH SPEED DUAL VERTICAL MOUNT EDGE CARD ASSEMBLY; MF: {'manufacturer': u'Samtec'}; MP: HSEC8-160-01-L-DV-A-BL; Value: *; Price: None; Availability: Unavailable; Package: None

## Nets that join several sheets
3V3: U_Gate Drive (6 pins), U_Gate Drive (6 pins), U_Gate Drive (6 pins)
15V_A_H: U_Gate Drive (U1_U_Gate_Drive#1.8), Power Supply (PS1.7)
15V_B_H: Power Supply (PS2.7), U_Gate Drive (U1_U_Gate_Drive#2.8)
15V_C_H: Power Supply (PS3.7), U_Gate Drive (U1_U_Gate_Drive#3.8)
15V_ISO: U_Gate Drive (R8_U_Gate_Drive#1.2 U2_U_Gate_Drive#1.5), Power Supply (PS4.7), U_Gate Drive (R8_U_Gate_Drive#2.2 U2_U_Gate_Drive#2.5), U_Gate Drive (R8_U_Gate_Drive#3.2 U2_U_Gate_Drive#3.5)
-5V_A_H: U_Phase (Q3_U_Phase#1.2 Q4_U_Phase#1.2), U_Gate Drive (R1_U_Gate_Drive#1.2 U1_U_Gate_Drive#1.5), Power Supply (PS1.5)
-5V_B_H: Power Supply (PS2.5), U_Phase (Q3_U_Phase#2.2 Q4_U_Phase#2.2), U_Gate Drive (R1_U_Gate_Drive#2.2 U1_U_Gate_Drive#2.5)
-5V_C_H: Power Supply (PS3.5), U_Phase (Q3_U_Phase#3.2 Q4_U_Phase#3.2), U_Gate Drive (R1_U_Gate_Drive#3.2 U1_U_Gate_Drive#3.5)
-5V_ISO: U_Phase (Q7_U_Phase#1.2 Q8_U_Phase#1.2), U_Gate Drive (U2_U_Gate_Drive#1.8), Power Supply (PS4.5), U_Phase (Q7_U_Phase#2.2 Q8_U_Phase#2.2), U_Gate Drive (U2_U_Gate_Drive#2.8), U_Phase (Q7_U_Phase#3.2 Q8_U_Phase#3.2), U_Gate Drive (U2_U_Gate_Drive#3.8)
GND: U_Gate Drive (12 pins), Power Supply (PS1.2 PS2.2 PS3.2 PS4.2), U_Gate Drive (12 pins), U_Gate Drive (12 pins), Microcontroller (17 pins)
NetC11_U_Gate_Drive#1_1: U_Phase (Q5_U_Phase#1.3 Q6_U_Phase#1.3), U_Gate Drive (C11_U_Gate_Drive#1.1 R13_U_Gate_Drive#1.1 U2_U_Gate_Drive#1.3)
NetC11_U_Gate_Drive#2_1: U_Phase (Q5_U_Phase#2.3 Q6_U_Phase#2.3), U_Gate Drive (C11_U_Gate_Drive#2.1 R13_U_Gate_Drive#2.1 U2_U_Gate_Drive#2.3)
NetC11_U_Gate_Drive#3_1: U_Phase (Q5_U_Phase#3.3 Q6_U_Phase#3.3), U_Gate Drive (C11_U_Gate_Drive#3.1 R13_U_Gate_Drive#3.1 U2_U_Gate_Drive#3.3)
NetD1_U_Gate_Drive#1_2: U_Phase (Q1_U_Phase#1.2 Q2_U_Phase#1.2), U_Gate Drive (D1_U_Gate_Drive#1.2)
NetD1_U_Gate_Drive#2_2: U_Phase (Q1_U_Phase#2.2 Q2_U_Phase#2.2), U_Gate Drive (D1_U_Gate_Drive#2.2)
NetD1_U_Gate_Drive#3_2: U_Phase (Q1_U_Phase#3.2 Q2_U_Phase#3.2), U_Gate Drive (D1_U_Gate_Drive#3.2)
NetJ1_50: U_Gate Drive (U1_U_Gate_Drive#1.13), Microcontroller (J1.50)
NetJ1_52: U_Gate Drive (U2_U_Gate_Drive#1.13), Microcontroller (J1.52)
NetJ1_54: U_Gate Drive (U1_U_Gate_Drive#2.13), Microcontroller (J1.54)
NetJ1_56: U_Gate Drive (U2_U_Gate_Drive#2.13), Microcontroller (J1.56)
NetJ1_58: U_Gate Drive (R7_U_Gate_Drive#3.1), Microcontroller (J1.58)
NetJ1_60: U_Gate Drive (R14_U_Gate_Drive#3.1), Microcontroller (J1.60)
NetJ1_66: U_Gate Drive (R7_U_Gate_Drive#1.1), Microcontroller (J1.66)
NetJ1_67: U_Gate Drive (U1_U_Gate_Drive#1.12), Microcontroller (J1.67)
NetJ1_68: U_Gate Drive (R14_U_Gate_Drive#1.1), Microcontroller (J1.68)
NetJ1_69: U_Gate Drive (U2_U_Gate_Drive#1.12), Microcontroller (J1.69)
NetJ1_70: U_Gate Drive (R14_U_Gate_Drive#2.1), Microcontroller (J1.70)
NetJ1_71: U_Gate Drive (U1_U_Gate_Drive#2.12), Microcontroller (J1.71)
NetJ1_72: U_Gate Drive (R7_U_Gate_Drive#2.1), Microcontroller (J1.72)
NetJ1_73: U_Gate Drive (U2_U_Gate_Drive#2.12), Microcontroller (J1.73)
NetJ1_74: U_Gate Drive (U1_U_Gate_Drive#3.12), Microcontroller (J1.74)
NetJ1_75: U_Gate Drive (U1_U_Gate_Drive#3.13), Microcontroller (J1.75)
NetJ1_76: U_Gate Drive (U2_U_Gate_Drive#3.12), Microcontroller (J1.76)
NetJ1_77: U_Gate Drive (U2_U_Gate_Drive#3.13), Microcontroller (J1.77)
NetJ1_78: U_Gate Drive (U2_U_Gate_Drive#1.16), Microcontroller (J1.78)
NetJ1_80: U_Gate Drive (U2_U_Gate_Drive#2.16), Microcontroller (J1.80)
NetJ1_82: U_Gate Drive (U2_U_Gate_Drive#3.16), Microcontroller (J1.82)
NetPS4_6: Power Supply (PS4.6), HV Sense (R37.1)
NetR15_U_Phase#1_1: U_Phase (R15_U_Phase#1.1 R17_U_Phase#1.1), U_Gate Drive (U1_U_Gate_Drive#1.6)
NetR15_U_Phase#2_1: U_Phase (R15_U_Phase#2.1 R17_U_Phase#2.1), U_Gate Drive (U1_U_Gate_Drive#2.6)
NetR15_U_Phase#3_1: U_Phase (R15_U_Phase#3.1 R17_U_Phase#3.1), U_Gate Drive (U1_U_Gate_Drive#3.6)
NetR16_U_Phase#1_1: U_Phase (R16_U_Phase#1.1 R18_U_Phase#1.1), U_Gate Drive (U1_U_Gate_Drive#1.4)
NetR16_U_Phase#2_1: U_Phase (R16_U_Phase#2.1 R18_U_Phase#2.1), U_Gate Drive (U1_U_Gate_Drive#2.4)
NetR16_U_Phase#3_1: U_Phase (R16_U_Phase#3.1 R18_U_Phase#3.1), U_Gate Drive (U1_U_Gate_Drive#3.4)
NetR19_U_Phase#1_1: U_Phase (R19_U_Phase#1.1 R20_U_Phase#1.1), U_Gate Drive (U1_U_Gate_Drive#1.7)
NetR19_U_Phase#2_1: U_Phase (R19_U_Phase#2.1 R20_U_Phase#2.1), U_Gate Drive (U1_U_Gate_Drive#2.7)
NetR19_U_Phase#3_1: U_Phase (R19_U_Phase#3.1 R20_U_Phase#3.1), U_Gate Drive (U1_U_Gate_Drive#3.7)
NetR21_U_Phase#1_1: U_Phase (R21_U_Phase#1.1 R23_U_Phase#1.1), U_Gate Drive (U2_U_Gate_Drive#1.6)
NetR21_U_Phase#2_1: U_Phase (R21_U_Phase#2.1 R23_U_Phase#2.1), U_Gate Drive (U2_U_Gate_Drive#2.6)
NetR21_U_Phase#3_1: U_Phase (R21_U_Phase#3.1 R23_U_Phase#3.1), U_Gate Drive (U2_U_Gate_Drive#3.6)
NetR22_U_Phase#1_1: U_Phase (R22_U_Phase#1.1 R24_U_Phase#1.1), U_Gate Drive (U2_U_Gate_Drive#1.4)
NetR22_U_Phase#2_1: U_Phase (R22_U_Phase#2.1 R24_U_Phase#2.1), U_Gate Drive (U2_U_Gate_Drive#2.4)
NetR22_U_Phase#3_1: U_Phase (R22_U_Phase#3.1 R24_U_Phase#3.1), U_Gate Drive (U2_U_Gate_Drive#3.4)
NetR25_U_Phase#1_1: U_Phase (R25_U_Phase#1.1 R26_U_Phase#1.1), U_Gate Drive (U2_U_Gate_Drive#1.7)
NetR25_U_Phase#2_1: U_Phase (R25_U_Phase#2.1 R26_U_Phase#2.1), U_Gate Drive (U2_U_Gate_Drive#2.7)
NetR25_U_Phase#3_1: U_Phase (R25_U_Phase#3.1 R26_U_Phase#3.1), U_Gate Drive (U2_U_Gate_Drive#3.7)
NetR36_1: U_Gate Drive (U2_U_Gate_Drive#1.1), HV Sense (R36.1 R37.2)
PHASE: U_Phase (Q1_U_Phase#1.3 Q2_U_Phase#1.3 Q5_U_Phase#1.2 Q6_U_Phase#1.2), U_Gate Drive (C5_U_Gate_Drive#1.1 D2_U_Gate_Drive#1.2 R6_U_Gate_Drive#1.1 U1_U_Gate_Drive#1.3)
PHASE: U_Phase (Q1_U_Phase#2.3 Q2_U_Phase#2.3 Q5_U_Phase#2.2 Q6_U_Phase#2.2), U_Gate Drive (C5_U_Gate_Drive#2.1 D2_U_Gate_Drive#2.2 R6_U_Gate_Drive#2.1 U1_U_Gate_Drive#2.3)
PHASE: U_Phase (Q1_U_Phase#3.3 Q2_U_Phase#3.3 Q5_U_Phase#3.2 Q6_U_Phase#3.2), U_Gate Drive (C5_U_Gate_Drive#3.1 D2_U_Gate_Drive#3.2 R6_U_Gate_Drive#3.1 U1_U_Gate_Drive#3.3)
PWM+: U_Gate Drive (R2_U_Gate_Drive#1.1 R12_U_Gate_Drive#1.1), Microcontroller (J1.49)
PWM+: U_Gate Drive (R2_U_Gate_Drive#2.1 R12_U_Gate_Drive#2.1), Microcontroller (J1.53)
PWM+: U_Gate Drive (R2_U_Gate_Drive#3.1 R12_U_Gate_Drive#3.1), Microcontroller (J1.57)
PWM-: U_Gate Drive (R5_U_Gate_Drive#1.1 R9_U_Gate_Drive#1.1), Microcontroller (J1.51)
PWM-: U_Gate Drive (R5_U_Gate_Drive#2.1 R9_U_Gate_Drive#2.1), Microcontroller (J1.55)
PWM-: U_Gate Drive (R5_U_Gate_Drive#3.1 R9_U_Gate_Drive#3.1), Microcontroller (J1.59)